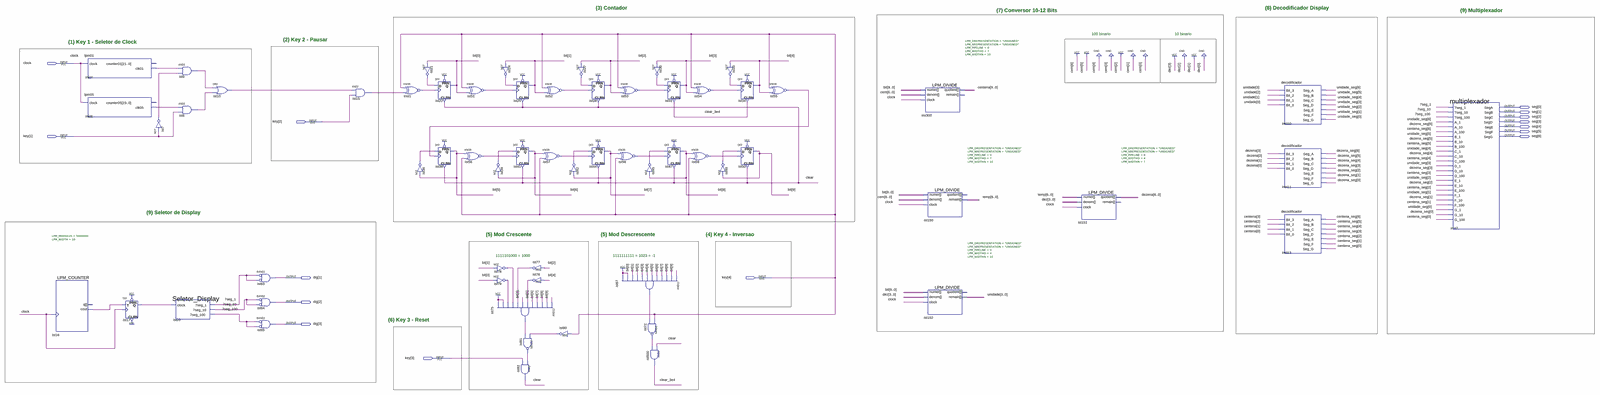
[diagram p0: schematic sheet, whole]
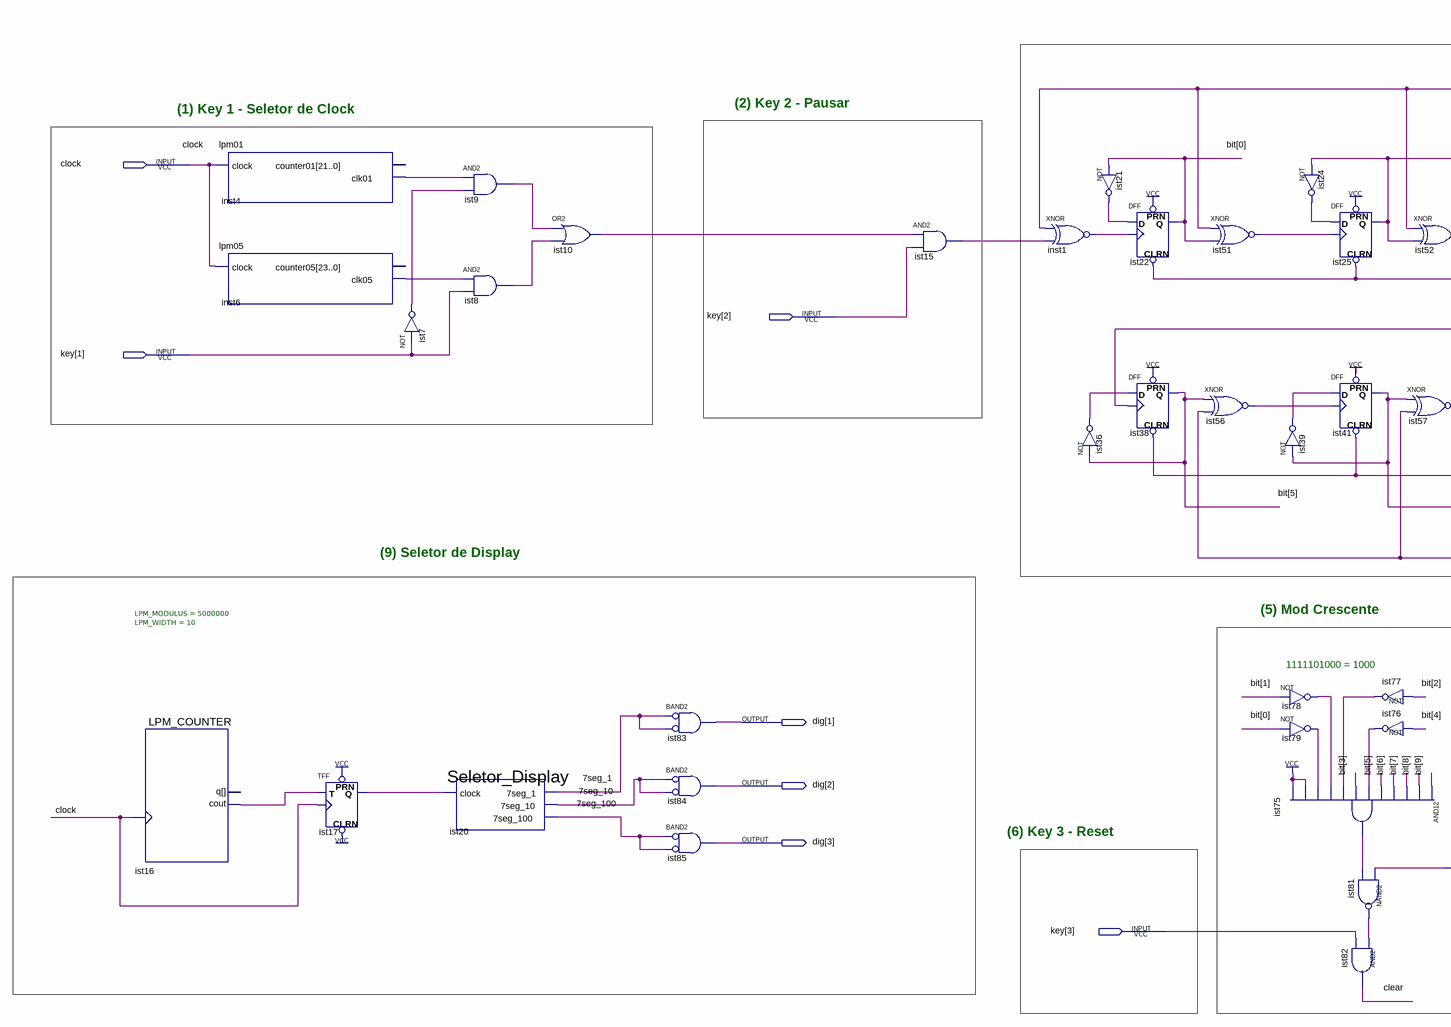
[diagram p1: schematic sheet, left part]
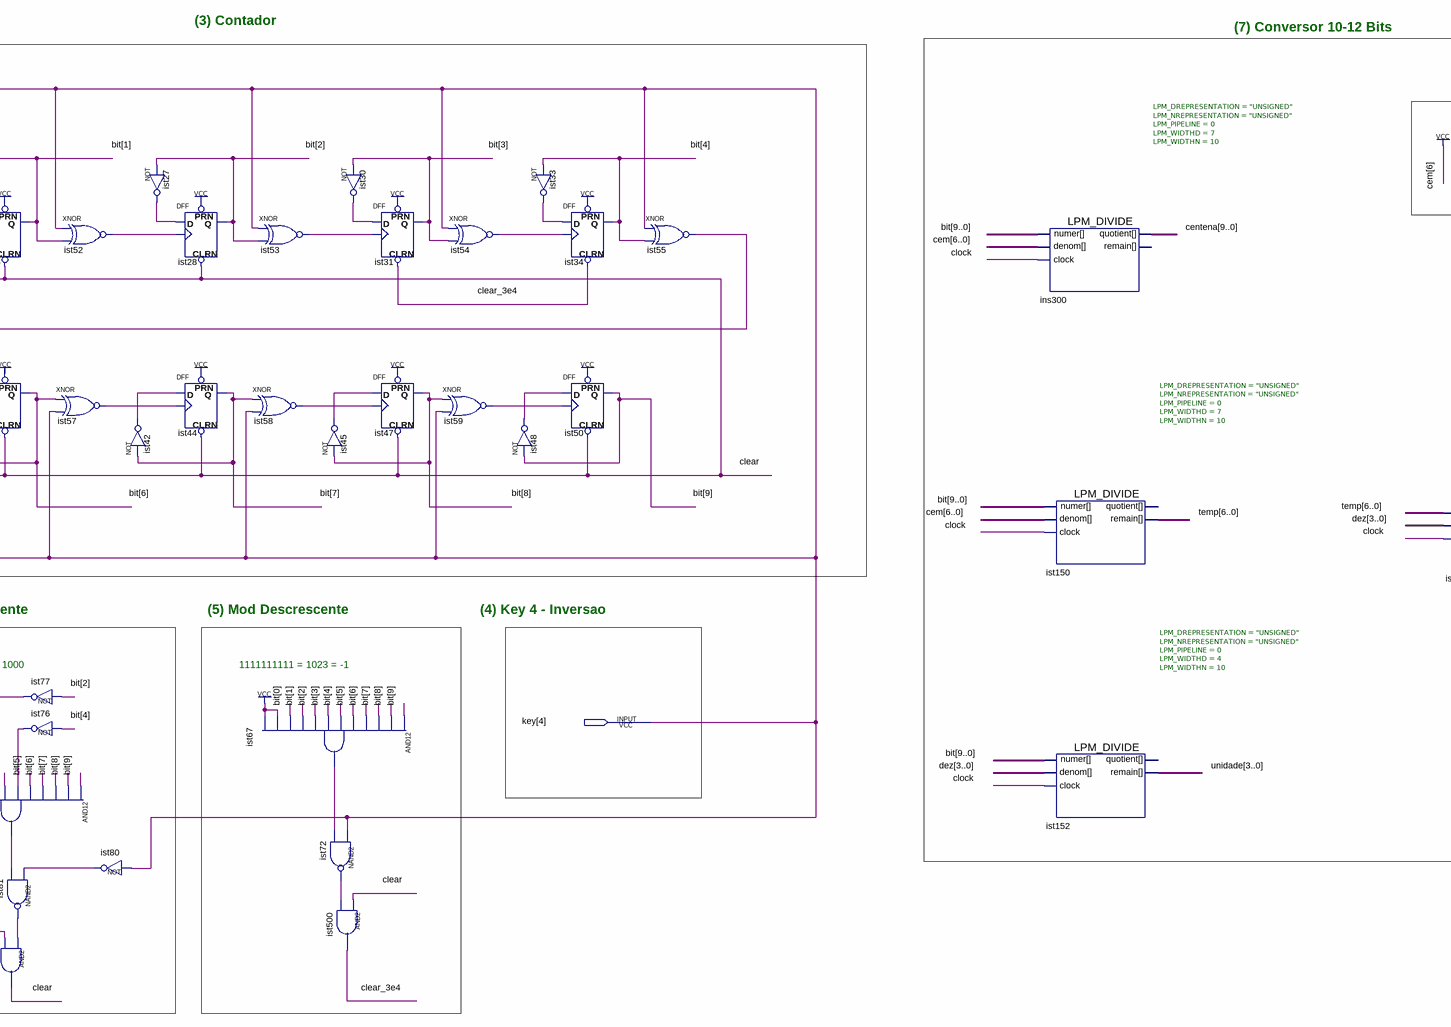
[diagram p2: schematic sheet, centre part]
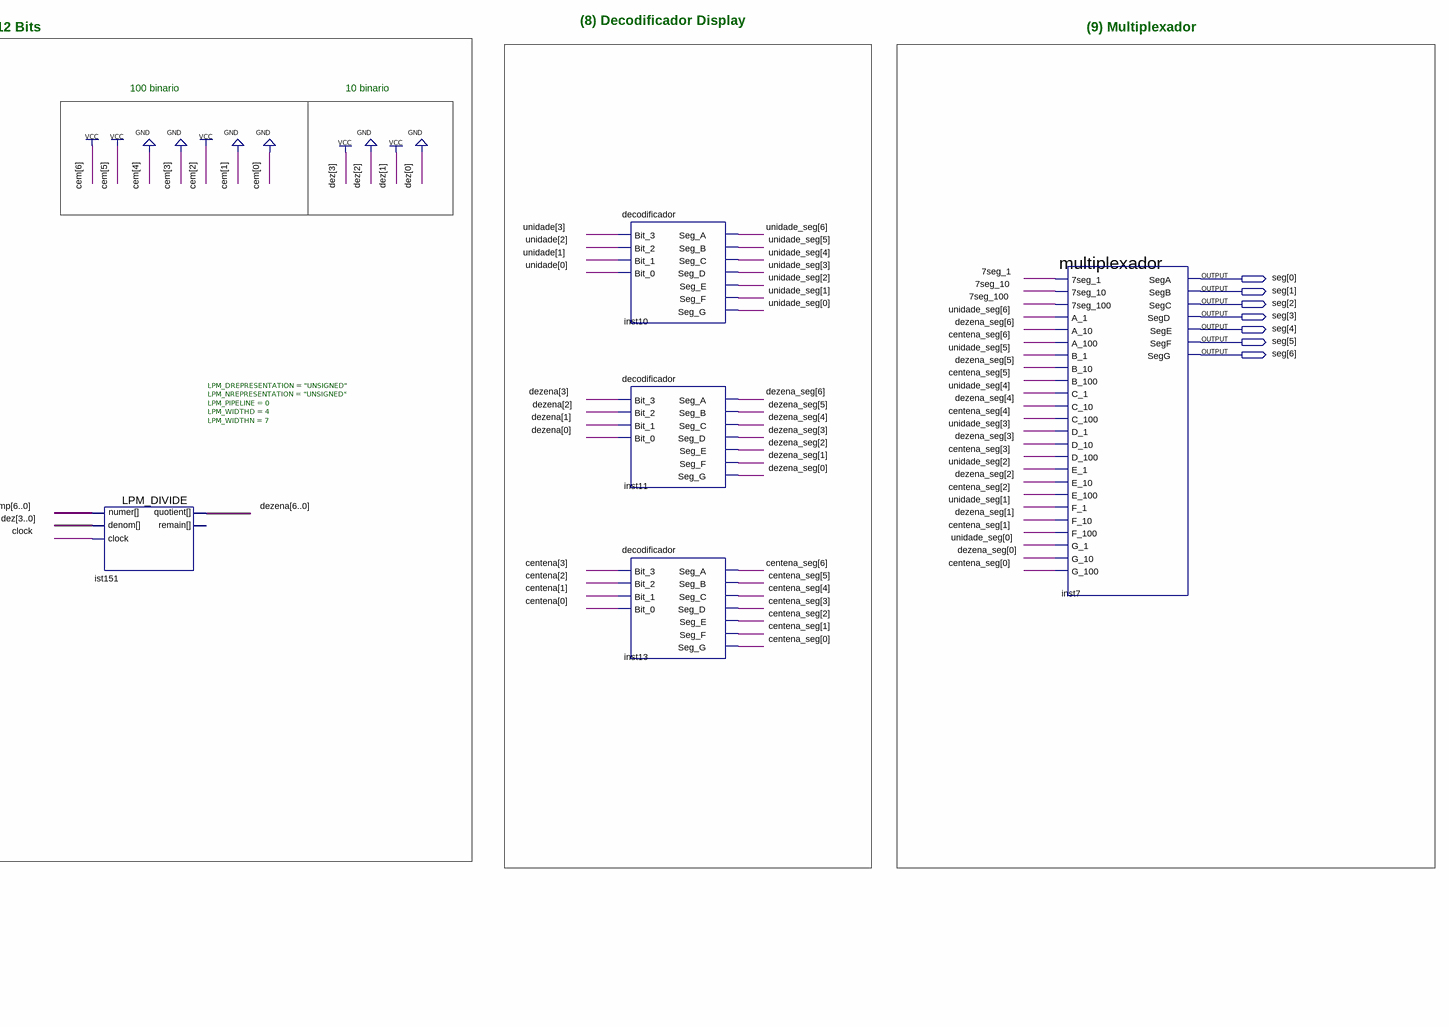
[diagram p3: schematic sheet, right part]
// Quartus schematic Contador_Sincrono.bdf as structural Verilog: 62 symbols, 15 pins
module Contador_Sincrono (
  input  clock,
  input  [4:1] key,
  output [6:0] seg,
  output [3:1] dig
);

  wire \7seg_1 , \7seg_10 , \7seg_100 , clear, clear_3e4, inst1_out, inst4_clk01, inst6_clk05, ist7_out,
       ist8_out, ist9_out, ist10_out, ist15_out, ist16_cout, ist17_q, ist21_out, ist24_out, ist27_out,
       ist30_out, ist33_out, ist36_out, ist39_out, ist42_out, ist45_out, ist48_out, ist51_out, ist52_out,
       ist53_out, ist54_out, ist55_out, ist56_out, ist57_out, ist58_out, ist59_out, ist67_out, ist72_out,
       ist75_out, ist76_out, ist77_out, ist78_out, ist79_out, ist80_out, ist81_out;
  wire [3:0] unidade;
  wire [6:0] centena_seg, dezena, dezena_seg, temp, unidade_seg;
  wire [9:0] \bit , centena;

  LPM_COUNTER #(.LPM_MODULUS(5000000), .LPM_WIDTH(10)) ist16 (.clock(clock), .cout(ist16_cout));  // open: q
  lpm01 inst4 (.clock(clock), .clk01(inst4_clk01));  // open: counter01
  lpm05 inst6 (.clock(clock), .clk05(inst6_clk05));  // open: counter05
  TFF ist17 (.PRN(1'b1), .CLRN(1'b1), .T(ist16_cout), .CLK(clock), .Q(ist17_q));
  not ist7 (ist7_out, key[1]);
  and ist9 (ist9_out, inst4_clk01, ist7_out);
  and ist8 (ist8_out, inst6_clk05, key[1]);
  Seletor_Display ist20 (.clock(ist17_q), .\7seg_1 (\7seg_1 ), .\7seg_10 (\7seg_10 ), .\7seg_100 (\7seg_100 ));
  or ist10 (ist10_out, ist9_out, ist8_out);
  and ist83 (dig[1], ~\7seg_1 , ~\7seg_1 );  // BAND2
  and ist84 (dig[2], ~\7seg_10 , ~\7seg_10 );  // BAND2
  and ist85 (dig[3], ~\7seg_100 , ~\7seg_100 );  // BAND2
  and ist15 (ist15_out, ist10_out, key[2]);
  xnor inst1 (inst1_out, key[4], ist15_out);
  not ist36 (ist36_out, \bit [5]);
  not ist21 (ist21_out, \bit [0]);
  DFF ist22 (.CLRN(clear), .CLK(inst1_out), .D(ist21_out), .PRN(1'b1), .Q(\bit [0]));
  DFF ist38 (.CLRN(clear), .CLK(ist55_out), .D(ist36_out), .PRN(1'b1), .Q(\bit [5]));
  xnor ist51 (ist51_out, key[4], \bit [0]);
  xnor ist56 (ist56_out, \bit [5], key[4]);
  not ist39 (ist39_out, \bit [6]);
  not ist78 (ist78_out, \bit [1]);
  not ist79 (ist79_out, \bit [0]);
  and ist75 (ist75_out, \bit [9], \bit [8], \bit [7], \bit [6], \bit [5], ist76_out, \bit [3], ist77_out, ist78_out, ist79_out, 1'b1, 1'b1);
  not ist24 (ist24_out, \bit [1]);
  DFF ist25 (.CLRN(clear), .CLK(ist51_out), .D(ist24_out), .PRN(1'b1), .Q(\bit [1]));
  DFF ist41 (.CLRN(clear), .CLK(ist56_out), .D(ist39_out), .PRN(1'b1), .Q(\bit [6]));
  and ist82 (clear, ist81_out, key[3]);
  not ist77 (ist77_out, \bit [2]);
  not ist76 (ist76_out, \bit [4]);
  nand ist81 (ist81_out, ist80_out, ist75_out);
  xnor ist52 (ist52_out, key[4], \bit [1]);
  xnor ist57 (ist57_out, \bit [6], key[4]);
  not ist80 (ist80_out, key[4]);
  not ist27 (ist27_out, \bit [2]);
  not ist42 (ist42_out, \bit [7]);
  DFF ist28 (.CLRN(clear), .CLK(ist52_out), .D(ist27_out), .PRN(1'b1), .Q(\bit [2]));
  DFF ist44 (.CLRN(clear), .CLK(ist57_out), .D(ist42_out), .PRN(1'b1), .Q(\bit [7]));
  xnor ist53 (ist53_out, key[4], \bit [2]);
  xnor ist58 (ist58_out, \bit [7], key[4]);
  and ist67 (ist67_out, \bit [9], \bit [8], \bit [7], \bit [6], \bit [5], \bit [4], \bit [3], \bit [2], \bit [1], \bit [0], 1'b1, 1'b1);
  not ist30 (ist30_out, \bit [3]);
  not ist45 (ist45_out, \bit [8]);
  nand ist72 (ist72_out, key[4], ist67_out);
  and ist500 (clear_3e4, clear, ist72_out);
  DFF ist31 (.CLRN(clear_3e4), .CLK(ist53_out), .D(ist30_out), .PRN(1'b1), .Q(\bit [3]));
  DFF ist47 (.CLRN(clear), .CLK(ist58_out), .D(ist45_out), .PRN(1'b1), .Q(\bit [8]));
  xnor ist54 (ist54_out, key[4], \bit [3]);
  xnor ist59 (ist59_out, \bit [8], key[4]);
  not ist33 (ist33_out, \bit [4]);
  not ist48 (ist48_out, \bit [9]);
  DFF ist34 (.CLRN(clear_3e4), .CLK(ist54_out), .D(ist33_out), .PRN(1'b1), .Q(\bit [4]));
  DFF ist50 (.CLRN(clear), .CLK(ist59_out), .D(ist48_out), .PRN(1'b1), .Q(\bit [9]));
  xnor ist55 (ist55_out, key[4], \bit [4]);
  LPM_DIVIDE #(.LPM_DREPRESENTATION("UNSIGNED"), .LPM_NREPRESENTATION("UNSIGNED"), .LPM_PIPELINE(0), .LPM_WIDTHD(7), .LPM_WIDTHN(10)) ins300 (
    .clock(clock), .denom(7'b1100100), .numer(\bit ), .quotient(centena));  // open: remain
  LPM_DIVIDE #(.LPM_DREPRESENTATION("UNSIGNED"), .LPM_NREPRESENTATION("UNSIGNED"), .LPM_PIPELINE(0), .LPM_WIDTHD(7), .LPM_WIDTHN(10)) ist150 (
    .clock(clock), .denom(7'b1100100), .numer(\bit ), .remain(temp));  // open: quotient
  LPM_DIVIDE #(.LPM_DREPRESENTATION("UNSIGNED"), .LPM_NREPRESENTATION("UNSIGNED"), .LPM_PIPELINE(0), .LPM_WIDTHD(4), .LPM_WIDTHN(10)) ist152 (
    .clock(clock), .denom(4'b1010), .numer(\bit ), .remain(unidade));  // open: quotient
  LPM_DIVIDE #(.LPM_DREPRESENTATION("UNSIGNED"), .LPM_NREPRESENTATION("UNSIGNED"), .LPM_PIPELINE(0), .LPM_WIDTHD(4), .LPM_WIDTHN(7)) ist151 (
    .clock(clock), .denom(4'b1010), .numer(temp), .quotient(dezena));  // open: remain
  decodificador inst10 (
    .Bit_3(unidade[3]), .Bit_2(unidade[2]), .Bit_1(unidade[1]), .Bit_0(unidade[0]), .Seg_A(unidade_seg[6]),
    .Seg_B(unidade_seg[5]), .Seg_C(unidade_seg[4]), .Seg_D(unidade_seg[3]), .Seg_E(unidade_seg[2]),
    .Seg_F(unidade_seg[1]), .Seg_G(unidade_seg[0]));
  decodificador inst11 (
    .Bit_3(dezena[3]), .Bit_2(dezena[2]), .Bit_1(dezena[1]), .Bit_0(dezena[0]), .Seg_A(dezena_seg[6]),
    .Seg_B(dezena_seg[5]), .Seg_C(dezena_seg[4]), .Seg_D(dezena_seg[3]), .Seg_E(dezena_seg[2]),
    .Seg_F(dezena_seg[1]), .Seg_G(dezena_seg[0]));
  decodificador inst13 (
    .Bit_3(centena[3]), .Bit_2(centena[2]), .Bit_1(centena[1]), .Bit_0(centena[0]), .Seg_A(centena_seg[6]),
    .Seg_B(centena_seg[5]), .Seg_C(centena_seg[4]), .Seg_D(centena_seg[3]), .Seg_E(centena_seg[2]),
    .Seg_F(centena_seg[1]), .Seg_G(centena_seg[0]));
  multiplexador inst7 (
    .\7seg_1 (\7seg_1 ), .\7seg_10 (\7seg_10 ), .\7seg_100 (\7seg_100 ), .A_1(unidade_seg[6]),
    .A_10(dezena_seg[6]), .A_100(centena_seg[6]), .B_1(unidade_seg[5]), .B_10(dezena_seg[5]),
    .B_100(centena_seg[5]), .C_1(unidade_seg[4]), .C_10(dezena_seg[4]), .C_100(centena_seg[4]),
    .D_1(unidade_seg[3]), .D_10(dezena_seg[3]), .D_100(centena_seg[3]), .E_1(unidade_seg[2]),
    .E_10(dezena_seg[2]), .E_100(centena_seg[2]), .F_1(unidade_seg[1]), .F_10(dezena_seg[1]),
    .F_100(centena_seg[1]), .G_1(unidade_seg[0]), .G_10(dezena_seg[0]), .G_100(centena_seg[0]),
    .SegA(seg[0]), .SegB(seg[1]), .SegC(seg[2]), .SegD(seg[3]), .SegE(seg[4]), .SegF(seg[5]), .SegG(seg[6]));

  // Notes on the sheet:
  //   (3) Contador
  //   (8) Decodificador Display
  //   (7) Conversor 10-12 Bits
  //   (9) Multiplexador
  //   100 binario
  //   10 binario
  //   (2) Key 2 - Pausar
  //   (1) Key 1 - Seletor de Clock
  //   (9) Seletor de Display
  //   (5) Mod Crescente
  //   (5) Mod Descrescente
  //   (4) Key 4 - Inversao
  //   1111101000 = 1000
  //   1111111111 = 1023 = -1
  //   (6) Key 3 - Reset
endmodule
